# EAGLE design QuantumPCB V1.0 (EAGLE 9.2.0)

## Sheet 1 of 4: Arduino Principal Connections
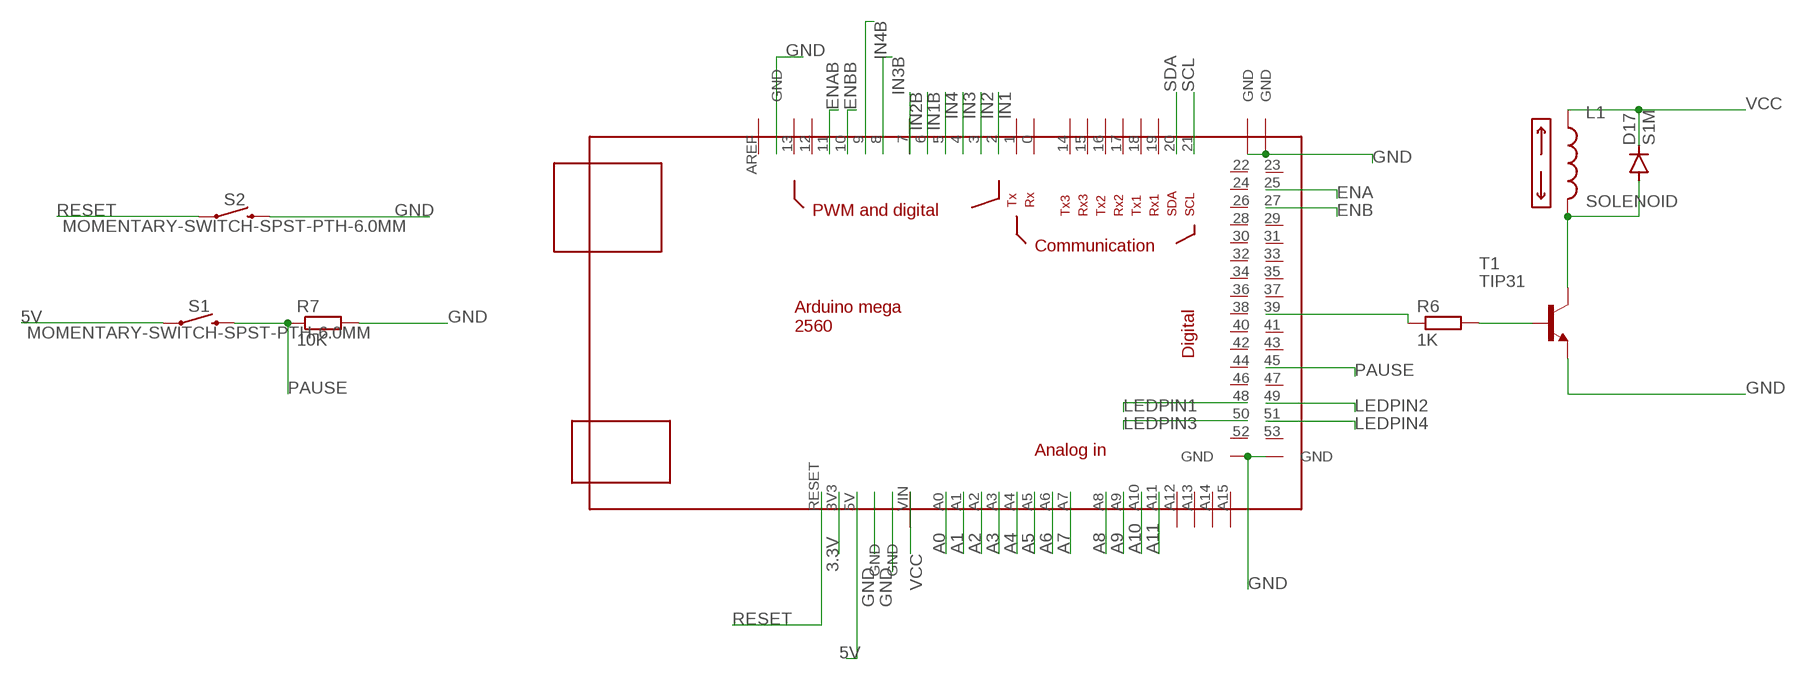
[diagram p0: schematic, sheet 1]

### Parts
D17  S1M  [SMA]
L1  SOLENOID  [1X02]
R6  1K  R-EU_R0603  [R0603]
R7  10K  R-EU_R0603  [R0603]
S1  MOMENTARY-SWITCH-SPST-PTH-6.0MM  [TACTILE_SWITCH_PTH_6.0MM]
S2  MOMENTARY-SWITCH-SPST-PTH-6.0MM  [TACTILE_SWITCH_PTH_6.0MM]
T1  TIP31  [TO220]
U$1  MEGA_DEVICE  [MEGAOUTLINE]

### Nets
3.3V: U$1.3V3 ; also sheet 3
5V: S1.1 U$1.5V ; also sheet 2,3,4
A0: U$1.A0 ; also sheet 2
A1: U$1.A1 ; also sheet 2
A2: U$1.A2 ; also sheet 2
A3: U$1.A3 ; also sheet 2
A4: U$1.A4 ; also sheet 2
A5: U$1.A5 ; also sheet 2
A6: U$1.A6 ; also sheet 2
A7: U$1.A7 ; also sheet 2
A8: U$1.A8 ; also sheet 2
A9: U$1.A9 ; also sheet 2
A10: U$1.A10 ; also sheet 2
A11: U$1.A11 ; also sheet 2
ENA: U$1.25 ; also sheet 4
ENAB: U$1.11 ; also sheet 4
ENB: U$1.27 ; also sheet 4
ENBB: U$1.10 ; also sheet 4
GND: R7.2 S2.3 T1.3(E) U$1.GND@1(GND) U$1.GND@2(GND) U$1.GND@3(GND) U$1.GND@4(GND) U$1.GND@5(GND) U$1.GND@6(GND) U$1.GND@7(GND) ; also sheet 2,3,4
IN1: U$1.2 ; also sheet 4
IN1B: U$1.6 ; also sheet 4
IN2: U$1.3 ; also sheet 4
IN2B: U$1.7 ; also sheet 4
IN3: U$1.4 ; also sheet 4
IN3B: U$1.8 ; also sheet 4
IN4: U$1.5 ; also sheet 4
IN4B: U$1.9 ; also sheet 4
LEDPIN1: U$1.48 ; also sheet 2
LEDPIN2: U$1.49 ; also sheet 2
LEDPIN3: U$1.50 ; also sheet 2
LEDPIN4: U$1.51 ; also sheet 2
N$5: R6.1 U$1.39
N$6: R6.2 T1.1(B)
N$7: D17.A L1.2 T1.2(C)
PAUSE: R7.1 S1.3 U$1.45
RESET: S2.1 U$1.RESET
SCL: U$1.21 ; also sheet 3
SDA: U$1.20 ; also sheet 3
VCC: D17.C L1.1 U$1.VIN ; also sheet 3,4
Unconnected: U$1.0 U$1.1 U$1.12 U$1.13 U$1.14 U$1.15 U$1.16 U$1.17 U$1.18 U$1.19 U$1.22 U$1.23 U$1.24 U$1.26 U$1.28 U$1.29 U$1.30 U$1.31 U$1.32 U$1.33 U$1.34 U$1.35 U$1.36 U$1.37 U$1.38 U$1.40 U$1.41 U$1.42 U$1.43 U$1.44 U$1.46 U$1.47 U$1.52 U$1.53 U$1.A12 U$1.A13 U$1.A14 U$1.A15 U$1.AREF

## Sheet 2 of 4: Light Sensor Connections
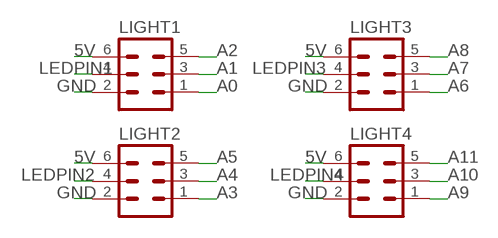
[diagram p1: schematic, sheet 2]

### Parts
LIGHT1  MA03-2  [MA03-2]
LIGHT2  MA03-2  [MA03-2]
LIGHT3  MA03-2  [MA03-2]
LIGHT4  MA03-2  [MA03-2]

### Nets
5V: LIGHT1.6 LIGHT2.6 LIGHT3.6 LIGHT4.6 ; also sheet 1,3,4
A0: LIGHT1.1 ; also sheet 1
A1: LIGHT1.3 ; also sheet 1
A2: LIGHT1.5 ; also sheet 1
A3: LIGHT2.1 ; also sheet 1
A4: LIGHT2.3 ; also sheet 1
A5: LIGHT2.5 ; also sheet 1
A6: LIGHT3.1 ; also sheet 1
A7: LIGHT3.3 ; also sheet 1
A8: LIGHT3.5 ; also sheet 1
A9: LIGHT4.1 ; also sheet 1
A10: LIGHT4.3 ; also sheet 1
A11: LIGHT4.5 ; also sheet 1
GND: LIGHT1.2 LIGHT2.2 LIGHT3.2 LIGHT4.2 ; also sheet 1,3,4
LEDPIN1: LIGHT1.4 ; also sheet 1
LEDPIN2: LIGHT2.4 ; also sheet 1
LEDPIN3: LIGHT3.4 ; also sheet 1
LEDPIN4: LIGHT4.4 ; also sheet 1

## Sheet 3 of 4: I2C Connections
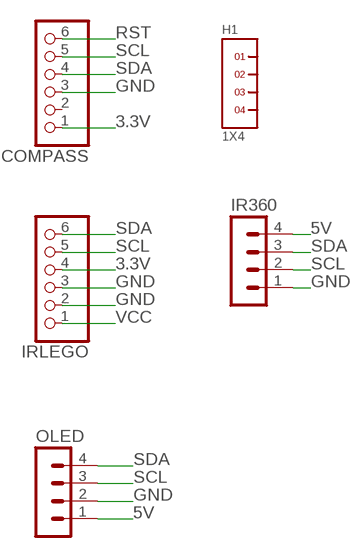
[diagram p2: schematic, sheet 3]

### Parts
COMPASS  PINHD-1X6  [1X06]
H1  1X4  [1X4]
IR360  MA04-1  [MA04-1]
IRLEGO  PINHD-1X6  [1X06]
OLED  MA04-1  [MA04-1]

### Nets
3.3V: COMPASS.1 IRLEGO.4 ; also sheet 1
5V: IR360.4 OLED.1 ; also sheet 1,2,4
GND: COMPASS.3 IR360.1 IRLEGO.2 IRLEGO.3 OLED.2 ; also sheet 1,2,4
RST: COMPASS.6
SCL: COMPASS.5 IR360.2 IRLEGO.5 OLED.3 ; also sheet 1
SDA: COMPASS.4 IR360.3 IRLEGO.6 OLED.4 ; also sheet 1
VCC: IRLEGO.1 ; also sheet 1,4
Unconnected: COMPASS.2 H1.1 H1.2 H1.3 H1.4

## Sheet 4 of 4: Motors and Power Supply
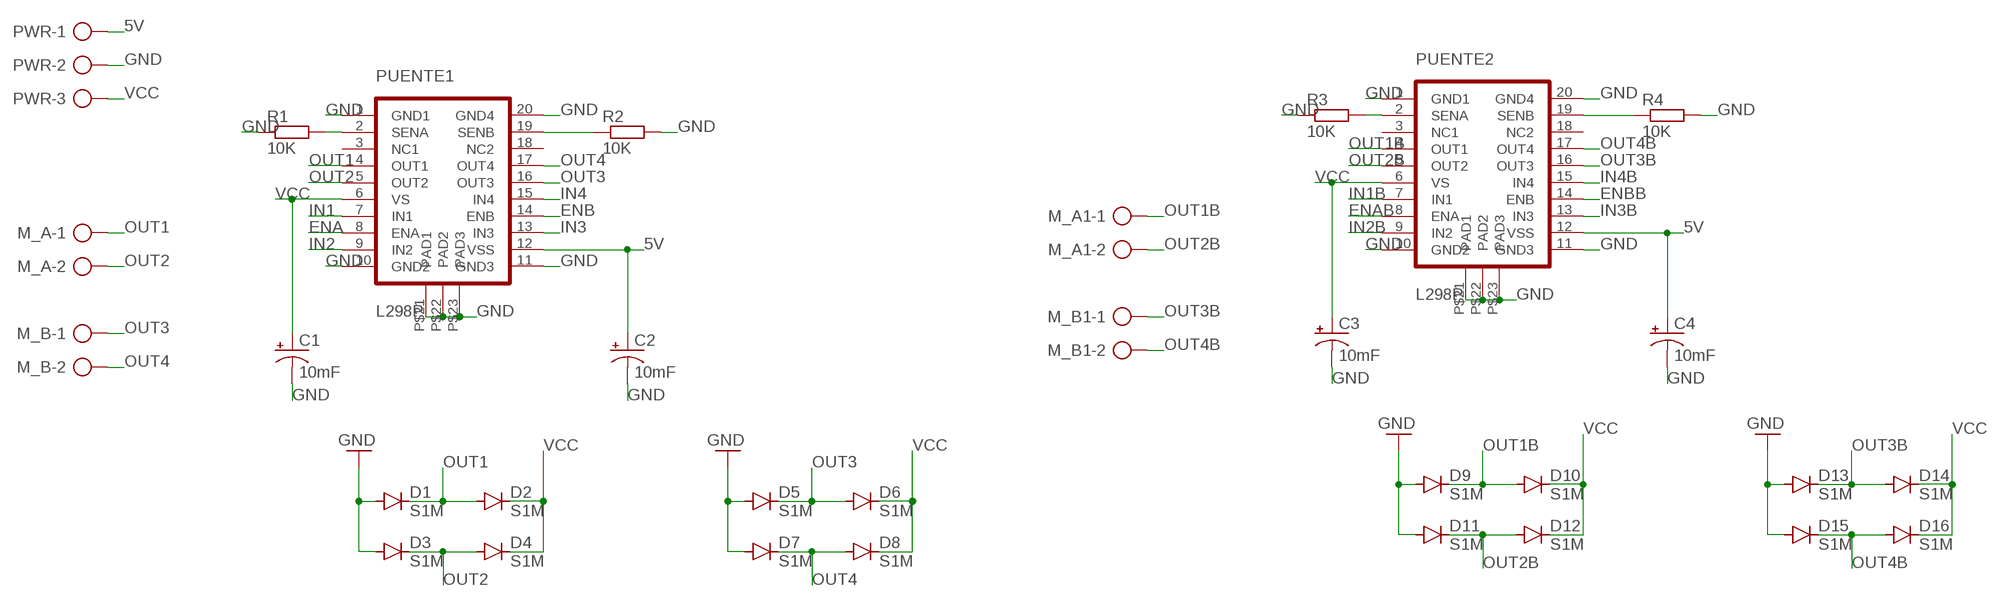
[diagram p3: schematic, sheet 4]

### Parts
C1  10mF  CPOL-USE2-5  [E2-5]
C2  10mF  CPOL-USE2-5  [E2-5]
C3  10mF  CPOL-USE2-5  [E2-5]
C4  10mF  CPOL-USE2-5  [E2-5]
D1  S1M  [SMA]
D2  S1M  [SMA]
D3  S1M  [SMA]
D4  S1M  [SMA]
D5  S1M  [SMA]
D6  S1M  [SMA]
D7  S1M  [SMA]
D8  S1M  [SMA]
D9  S1M  [SMA]
D10  S1M  [SMA]
D11  S1M  [SMA]
D12  S1M  [SMA]
D13  S1M  [SMA]
D14  S1M  [SMA]
D15  S1M  [SMA]
D16  S1M  [SMA]
M_A  AK500/2  [AK500/2]
M_A1  AK500/2  [AK500/2]
M_B  AK500/2  [AK500/2]
M_B1  AK500/2  [AK500/2]
PUENTE1  L298P  [POWER-SO20]
PUENTE2  L298P  [POWER-SO20]
PWR  AK500/3  [AK500/3]
R1  10K  R-EU_R0603  [R0603]
R2  10K  R-EU_R0603  [R0603]
R3  10K  R-EU_R0603  [R0603]
R4  10K  R-EU_R0603  [R0603]

### Nets
5V: C2.+ C4.+ PUENTE1.P$12(VSS) PUENTE2.P$12(VSS) PWR.1 ; also sheet 1,2,3
ENA: PUENTE1.P$8(ENA) ; also sheet 1
ENAB: PUENTE2.P$8(ENA) ; also sheet 1
ENB: PUENTE1.P$14(ENB) ; also sheet 1
ENBB: PUENTE2.P$14(ENB) ; also sheet 1
GND: C1.- C2.- C3.- C4.- D1.A D3.A D5.A D7.A D9.A D11.A D13.A D15.A PUENTE1.P$1(GND1) PUENTE1.P$10(GND2) PUENTE1.P$11(GND3) PUENTE1.P$20(GND4) PUENTE1.P$21(PAD1) PUENTE1.P$22(PAD2) PUENTE1.P$23(PAD3) PUENTE2.P$1(GND1) PUENTE2.P$10(GND2) PUENTE2.P$11(GND3) PUENTE2.P$20(GND4) PUENTE2.P$21(PAD1) PUENTE2.P$22(PAD2) PUENTE2.P$23(PAD3) PWR.2 R1.1 R2.2 R3.1 R4.2 ; also sheet 1,2,3
IN1: PUENTE1.P$7(IN1) ; also sheet 1
IN1B: PUENTE2.P$7(IN1) ; also sheet 1
IN2: PUENTE1.P$9(IN2) ; also sheet 1
IN2B: PUENTE2.P$9(IN2) ; also sheet 1
IN3: PUENTE1.P$13(IN3) ; also sheet 1
IN3B: PUENTE2.P$13(IN3) ; also sheet 1
IN4: PUENTE1.P$15(IN4) ; also sheet 1
IN4B: PUENTE2.P$15(IN4) ; also sheet 1
N$1: PUENTE1.P$2(SENA) R1.2
N$2: PUENTE1.P$19(SENB) R2.1
N$3: PUENTE2.P$2(SENA) R3.2
N$4: PUENTE2.P$19(SENB) R4.1
OUT1: D1.C D2.A M_A.1 PUENTE1.P$4(OUT1)
OUT1B: D9.C D10.A M_A1.1 PUENTE2.P$4(OUT1)
OUT2: D3.C D4.A M_A.2 PUENTE1.P$5(OUT2)
OUT2B: D11.C D12.A M_A1.2 PUENTE2.P$5(OUT2)
OUT3: D5.C D6.A M_B.1 PUENTE1.P$16(OUT3)
OUT3B: D13.C D14.A M_B1.1 PUENTE2.P$16(OUT3)
OUT4: D7.C D8.A M_B.2 PUENTE1.P$17(OUT4)
OUT4B: D15.C D16.A M_B1.2 PUENTE2.P$17(OUT4)
VCC: C1.+ C3.+ D2.C D4.C D6.C D8.C D10.C D12.C D14.C D16.C PUENTE1.P$6(VS) PUENTE2.P$6(VS) PWR.3 ; also sheet 1,3
Unconnected: PUENTE1.P$3(NC1) PUENTE1.P$18(NC2) PUENTE2.P$3(NC1) PUENTE2.P$18(NC2)

## Library data of the parts
C1-C4 = adafruit:CPOL-US: POLARIZED CAPACITOR, American symbol
COMPASS IRLEGO = adafruit:PINHD-1X6: PIN HEADER
D1-D17 = diode:S1M
H1 = headers(.1in):1X4
IR360 OLED = con-lstb:MA04-1: PIN HEADER; OC_FARNELL: unknown; OC_NEWARK: unknown
L1 = my_mixed:SOLENOID
LIGHT1-LIGHT4 = con-lstb:MA03-2: PIN HEADER; OC_FARNELL: unknown; OC_NEWARK: unknown
M_A M_A1 M_B M_B1 = con-ptr500:AK500/2: CONNECTOR; OC_FARNELL: unknown; OC_NEWARK: unknown
PUENTE1 PUENTE2 = L298P:L298P: L298P DUAL FUL-BRIDGE DRIVER PowerSO20; AVAILABILITY: Unavailable; DESCRIPTION: L298 Series Dual Full Bridge 4 A 46 V Driver Surface Mount - PowerSO-20; MF: STMicroelectronics; MP: L298P; PACKAGE: SO-20 STMicroelectronics; PRICE: None
PWR = con-ptr500:AK500/3: CONNECTOR; OC_FARNELL: unknown; OC_NEWARK: unknown
R1-R4 R6 R7 = rcl:R-EU_: RESISTOR, European symbol; SPICEPREFIX: R
S1 S2 = SparkFun-Switches:MOMENTARY-SWITCH-SPST: Momentary Switch (Pushbutton) - SPST Normally-open (NO) SPST momentary switches (buttons, pushbuttons). Variants PTH-12MM - 12mm square, through-hole Momentary Pushbutton Switch - 12mm Square <https://www.sparkfun.com/products/9190> (COM-09190) PTH-6.0MM, PTH-6.0MM-KIT - 6.0mm square, through-hole Mini Pushbutton Switch <https://www.sparkfun.com/products/97> (COM-00097) KIT package intended for soldering kit's - only one side of pads' copper is exposed. PTH-RIGHT-ANGLE-KIT - Right-angle, through-hole Right Angle Tactile Button <https://www.sparkfun.com/products/10791> - Used on SparkFun BigTime Watch Kit <https://www.sparkfun.com/products/11734> SMD-12MM - 12mm square, surface-mount Tactile Button - SMD (12mm) <https://www.sparkfun.com/products/12993> (COM-12993) Used on SparkFun PicoBoard <https://www.sparkfun.com/products/11888> SMD-4.5MM - 4.5mm Square Trackball Switch Used on SparkFun Blackberry Trackballer Breakout <https://www.sparkfun.com/products/13169> SMD-4.6MMX2.8MM - 4.60mm x 2.80mm, surface mount Used on SparkFun SAMD21 Mini Breakout <https://www.sparkfun.com/products/13664> SMD-5.2MM, SMD-5.2-REDUNDANT - 5.2mm square, surface-mount Mini Pushbutton Switch - SMD <https://www.sparkfun.com/products/8720> (COM-08720) Used on Arduino Pro Mini <https://www.sparkfun.com/products/11114> REDUNDANT package connects both switch circuits together SMD-6.0X3.5MM - 6.0 x 3.5mm, surface mount Momentary Reset Switch SMD <https://www.sparkfun.com/products/8229> (COM-08229) SMD-6.2MM-TALL - 6.2mm square, surface mount Tactile Button - SMD (6mm) <https://www.sparkfun.com/products/12992> Used on SparkFun Digital Sandbox <https://www.sparkfun.com/products/12651> SMD-RIGHT-ANGLE - Right-angle, surface mount Used on SparkFun Block for Intel® Edison - Arduino <https://www.sparkfun.com/products/13036>; PROD_ID: SWCH-08441; SF_SKU: COM-00097
T1 = transistor:TIP31: NPN Transistor Medium Power Linear Switching Applications Source: http://onsemi.com
U$1 = ArduinoMegaOutline:MEGA_DEVICE: mega card as device

## Board
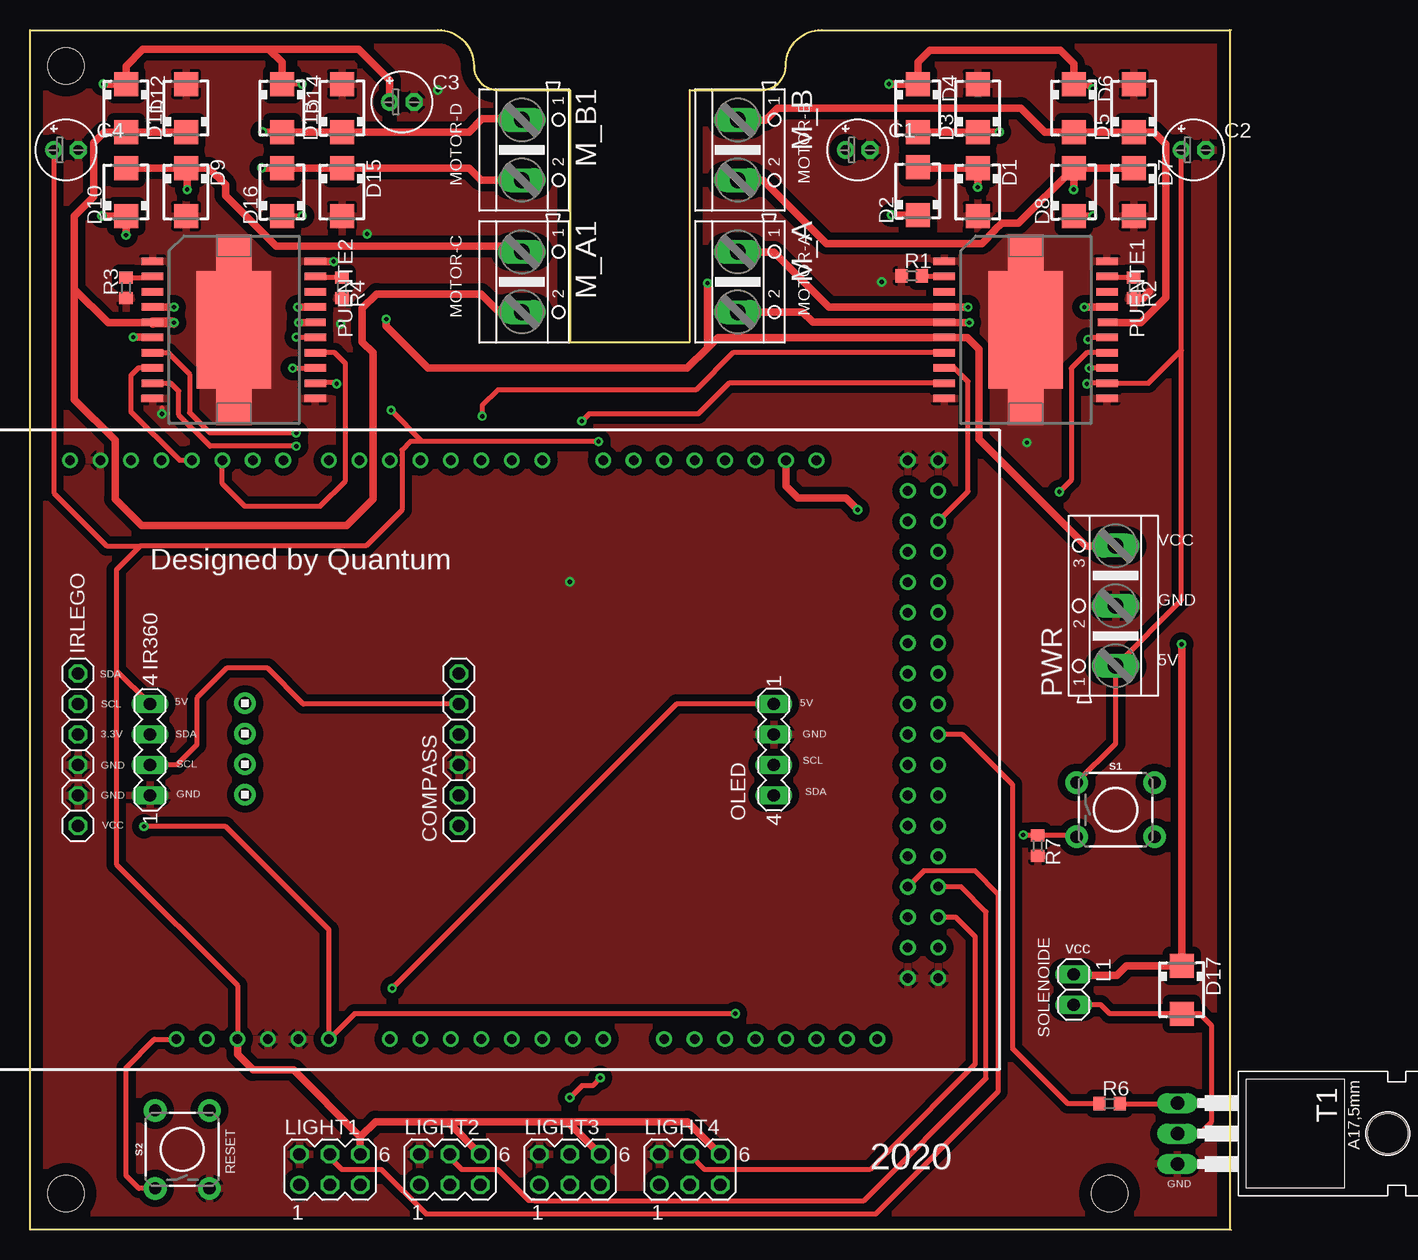
[diagram p4: board, top side]
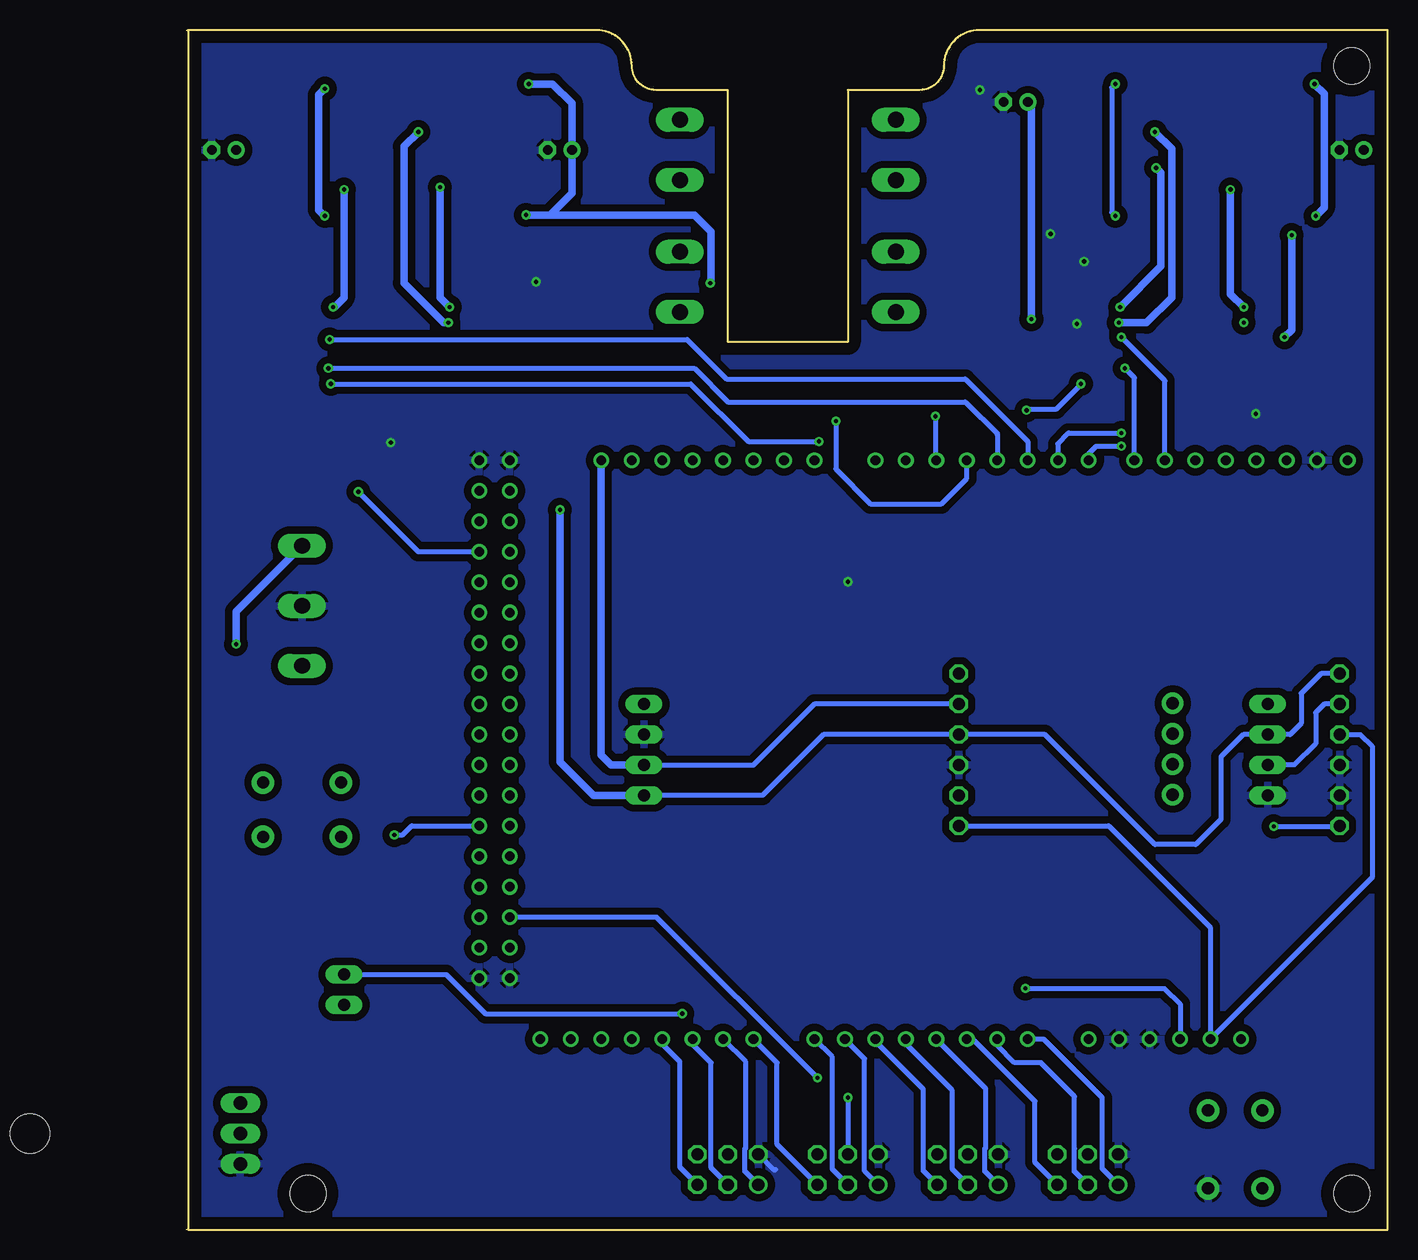
[diagram p5: board, bottom side, seen from below]

Size 100.17 x 100 mm. Coordinates in mm from the lower left corner, seen from the top.
Outline: 100,0 100.17,0
Outline: 100.17,100 100,100
Outline: 100,100 66,100 arc90 63,97 arc-90 61,95 55,95 55,74 45,74 45,95 39,95 arc-90 37,97 arc90 34,100 0,100 0,0 100,0
Outline: 100,100 100,0
Copper layers (1*16): Top 0.035mm / dielectric 1.5mm / Bottom 0.035mm
Design rules "default": minimum track width 6mil, minimum drill 0.35mm, track to track 6mil, track to pad 6mil, pad to pad 6mil, via to via 6mil, smd to smd 6mil, copper to edge 40mil, drill to drill 6mil, minimum pad ring 10mil, minimum via ring 8mil, stop-mask expansion 4mil, vias tented up to drill 0mil, thermal gap 10mil
Holes 3 mm at 3,3 3,97 90,3

### Footprints (pad centres in the part's own frame; a part is rotated, then mirrored left to right if it is on the bottom)
E2-5 = drill 0.813 pad 1.422: + -1.016,0 | drill 0.813 pad 1.422 octagon: - 1.016,0
1X06 = drill 1.016 octagon: 1 -6.35,0; 2 -3.81,0; 3 -1.27,0; 4 1.27,0; 5 3.81,0; 6 6.35,0
SMA = smd 2 x 2: A 2,0; C -2,0
1X4 = drill 1.016 pad 1.778: 1 0,0; 2 2.54,0; 3 5.08,0; 4 7.62,0
MA04-1 = drill 1.016 long: 1 -3.81,0; 2 -1.27,0; 3 1.27,0; 4 3.81,0
1X02 = drill 1.016 long: 1 -1.27,0; 2 1.27,0
MA03-2 = drill 1.016: 1 -2.54,-1.27 | drill 1.016 octagon: 2 -2.54,1.27; 3 0,-1.27; 4 0,1.27; 5 2.54,-1.27; 6 2.54,1.27
AK500/2 = drill 1.321 long: 1 -2.515,0; 2 2.515,0
POWER-SO20 = smd 0.635 x 1.778: P$1 -5.715,-6.782; P$2 -4.445,-6.782; P$3 -3.175,-6.782; P$4 -1.905,-6.782; P$5 -0.635,-6.782; P$6 0.635,-6.782; P$7 1.905,-6.782; P$8 3.175,-6.782; P$9 4.445,-6.782; P$10 5.715,-6.782; P$11 5.715,6.782; P$12 4.445,6.782; P$13 3.175,6.782; P$14 1.905,6.782; P$15 0.635,6.782; P$17 -1.905,6.782; P$18 -3.175,6.782; P$19 -4.445,6.782; P$20 -5.715,6.782 | smd 0.635 x 1.651: P$16 -0.635,6.833 | smd 9.804 x 6.198: P$21 0,0 | smd 3.048 x 2.921: P$22 -6.426,0; P$23 6.426,0
AK500/3 = drill 1.321 long: 1 -5.004,0; 2 0,0; 3 5.004,0
R0603 = smd 1 x 1.1: 1 -0.85,0; 2 0.85,0
TACTILE_SWITCH_PTH_6.0MM = drill 1.016 pad 1.88: 1 -3.251,2.261; 2 3.251,2.261; 3 -3.251,-2.261; 4 3.251,-2.261
TO220 = drill 1.118 long: 1 -2.54,-6.35; 2 0,-6.35; 3 2.54,-6.35 | hole 3.302: 0,11.176
MEGAOUTLINE = drill 0.8: 0 12.7,24.13; 1 10.16,24.13; 2 7.62,24.13; 3 5.08,24.13; 3V3 -15.24,-24.13; 4 2.54,24.13; 5 0,24.13; 5V -12.7,-24.13; 6 -2.54,24.13; 7 -5.08,24.13; 8 -8.89,24.13; 9 -11.43,24.13; 10 -13.97,24.13; 11 -16.51,24.13; 12 -19.05,24.13; 13 -21.59,24.13; 14 17.78,24.13; 15 20.32,24.13; 16 22.86,24.13; 17 25.4,24.13; 18 27.94,24.13; 19 30.48,24.13; 20 33.02,24.13; 21 35.56,24.13; 22 43.18,21.59; 23 45.72,21.59; 24 43.18,19.05; 25 45.72,19.05; 26 43.18,16.51; 27 45.72,16.51; 28 43.18,13.97; 29 45.72,13.97; 30 43.18,11.43; 31 45.72,11.43; 32 43.18,8.89; 33 45.72,8.89; 34 43.18,6.35; 35 45.72,6.35; 36 43.18,3.81; 37 45.72,3.81; 38 43.18,1.27; 39 45.72,1.27; 40 43.18,-1.27; 41 45.72,-1.27; 42 43.18,-3.81; 43 45.72,-3.81; 44 43.18,-6.35; 45 45.72,-6.35; 46 43.18,-8.89; 47 45.72,-8.89; 48 43.18,-11.43; 49 45.72,-11.43; 50 43.18,-13.97; 51 45.72,-13.97; 52 43.18,-16.51; 53 45.72,-16.51; A0 0,-24.13; A1 2.54,-24.13; A2 5.08,-24.13; A3 7.62,-24.13; A4 10.16,-24.13; A5 12.7,-24.13; A6 15.24,-24.13; A7 17.78,-24.13; A8 22.86,-24.13; A9 25.4,-24.13; A10 27.94,-24.13; A11 30.48,-24.13; A12 33.02,-24.13; A13 35.56,-24.13; A14 38.1,-24.13; A15 40.64,-24.13; AREF -26.67,24.13; GND@1 -24.13,24.13; GND@2 -10.16,-24.13; GND@3 -7.62,-24.13; GND@4 43.18,24.13; GND@5 45.72,24.13; GND@6 43.18,-19.05; GND@7 45.72,-19.05; RESET -17.78,-24.13; VIN -5.08,-24.13

### Placement (x,y rotation side)
C1  69,90 0 top
C2  97,90 0 top
C3  31,94 0 top
C4  3,90 0 top
COMPASS  35.75,40 90 top
D1  79,86.5 270 top
D2  74,86.58 90 top
D3  79,93.5 90 top
D4  74,93.5 270 top
D5  92,93.5 90 top
D6  87,93.5 270 top
D7  92,86.5 270 top
D8  87,86.5 90 top
D9  13,86.5 270 top
D10  8,86.5 90 top
D11  13,93.5 90 top
D12  8,93.5 270 top
D13  26,93.5 90 top
D14  21,93.5 270 top
D15  26,86.5 270 top
D16  21,86.5 90 top
D17  96,20 270 top
H1  17.92,36.25 90 top
IR360  10,40 90 top
IRLEGO  4,40 90 top
L1  87,20 270 top
LIGHT1  25,5 0 top
LIGHT2  35,5 0 top
LIGHT3  45,5 0 top
LIGHT4  55,5 0 top
M_A  59,79 270 top
M_A1  41,79 270 top
M_B  59,90 270 top
M_B1  41,90 270 top
OLED  62,40 270 top
PUENTE1  83,75 270 top
PUENTE2  17,75 270 top
PWR  90.5,52 90 top
R1  73.5,79.5 0 top
R2  92,78.5 270 top
R3  8,78.5 90 top
R4  26,78.5 270 top
R6  90,10.5 0 top
R7  84,32 270 top
S1  90.5,35 0 top
S2  12.7,6.68 90 top
T1  102,8 270 top
U$1  30,40 0 top

### Tracks (layer width: path | path; a pad name or v marks a point on that pad's centre or on a via)
3.3V
  Bottom 0.406: COMPASS.1 23.25,33.65 14.8,25.2 14.8,16.11 14.9,16.01 | IRLEGO.4 2.27,41.27 1.29,40.3 1.29,29.34 U$1.3V3
  Bottom 0.61: 14.9,16.01 U$1.3V3
5V  (via drill 0.35)
  Top 0.406: C4.+ 1.98,61.42 6.4,57 9.2,57 | 7.2,46.61 7.2,55 9.2,57 | S1.1 90.5,40.51 PWR.1 95.98,52.48 95.98,73.3 | 95.98,73.3 C2.+ | 95.98,73.3 93.24,70.56 PUENTE1.P$12 88.16,70.56 v88.1,70.5 | v47.4,65.7 32.7,65.7 | 32.7,65.7 v30.1,68.3 | 32.7,65.7 31.7,65.7 31,65 31,64.56 31.01,64.55 31.01,63.71 31,63.7 31,60 28,57 9.2,57 | PUENTE2.P$12 23.83,70.6 25.47,70.6 v25.57,70.5 | IR360.4 7.2,46.61 | OLED.1 53.91,43.81 v30.2,20.1 | U$1.5V 17.3,20.35 7.2,30.45 7.2,46.61
  Top 0.61: 35,9 28.8,9 27.54,7.74 | 35,9 44.81,9 | 44.81,9 54.81,9 LIGHT4.6 | LIGHT1.6 27.54,7.74 | 27.54,7.74 21.98,13.3 18.6,13.3 17.3,14.6 U$1.5V | LIGHT3.6 44.81,9 | LIGHT2.6 35,8.81 35,9
  Bottom 0.406: v88.1,70.5 58.1,70.5 53.3,65.7 v47.4,65.7 | v30.1,68.3 30,68.4 27.6,68.4 25.57,70.43 v25.57,70.5 | v30.2,20.1 18.6,20.1 17.3,18.8 U$1.5V
A0
  Bottom 0.406: LIGHT1.1 23.8,5.07 23.8,11 28.67,15.87 U$1.A0
A1
  Bottom 0.406: LIGHT1.3 26.12,4.85 26.12,6.73 26.1,6.75 26.1,11.1 28.9,13.9 31.1,13.9 32.54,15.34 U$1.A1
A2
  Bottom 0.406: LIGHT1.5 29.4,5.59 29.4,10.7 34.57,15.87 U$1.A2
A3
  Bottom 0.406: LIGHT2.1 33.58,4.85 33.58,6.73 33.5,6.81 33.5,11.75 U$1.A3
A4
  Bottom 0.406: LIGHT2.3 36.3,5.03 36.3,11.6 40.16,15.46 U$1.A4
A5
  Bottom 0.406: LIGHT2.5 38.7,4.89 38.7,11.7 42.7,15.7 U$1.A5
A6
  Bottom 0.406: LIGHT3.1 43.6,4.87 43.6,14.23 U$1.A6
A7
  Bottom 0.406: LIGHT3.3 46.3,5.03 46.3,14.39 U$1.A7
A8
  Bottom 0.406: LIGHT3.5 50.9,7.09 50.9,13.91 U$1.A8
A9
  Bottom 0.406: LIGHT4.1 53.58,4.85 53.58,6.73 53.5,6.81 53.5,13.97 U$1.A9
A10
  Bottom 0.406: LIGHT4.3 56.4,5.13 56.4,13.9 57.94,15.44 U$1.A10
A11
  Bottom 0.406: LIGHT4.5 59,5.19 59,14 60.48,15.48 U$1.A11
ENA
  Top 0.406: U$1.25 78.2,61.53 78.2,70.7 77.08,71.83 PUENTE1.P$8
ENAB
  Top 0.406: PUENTE2.P$8 9.03,71.83 8.4,71.2 8.4,68.2 12.47,64.13 U$1.11
ENB  (via drill 0.35)
  Top 0.406: PUENTE1.P$14 88.09,73.09 86.8,71.8 86.8,62.5 v85.8,61.5
  Bottom 0.406: v85.8,61.5 80.81,56.51 U$1.27
ENBB
  Top 0.406: PUENTE2.P$14 25.41,73.09 26.3,72.2 26.3,62.4 24.2,60.3 17.9,60.3 16.03,62.17 U$1.10
GND  (via drill 0.35)
  Top 0.406: v11,68 11,68.5
  Top 0.61: R2.2 92.75,77.65 93.3,78.2 | PUENTE2.P$20 23.8,80.7 v25.3,80.7
  Bottom 0.406: LIGHT4.2 51.19,5 51,5
  other vias: 45,54 34,95 28.1,83 71,79 83.1,65.6 25.9,75.5
  pour Top (isolate 0.61): 0,100 35,100 37,98 37,96 38,95 40,95 45,95 45,74 55,74 55,95 62,95 63,96 63,98 64,99 65,100 69,100 100,100 100,0 0,0
  pour Bottom (isolate 0.61): 0,100 100,100 100,0 0,0
IN1  (via drill 0.35)
  Top 0.406: PUENTE1.P$7 58.59,73.09 55.5,70 39,70 37.7,68.7 v37.7,67.8 37.7,67.7
  Bottom 0.406: v37.7,67.8 37.7,64.21 U$1.2
IN1B  (via drill 0.35)
  Top 0.406: PUENTE2.P$7 11.51,73.09 13.3,71.3 13.3,68.1 15,66.4 v22.2,66.4
  Bottom 0.406: U$1.6 27.46,65.46 27.5,65.5 26.6,66.4 v22.2,66.4 22.1,66.4
IN2  (via drill 0.35)
  Top 0.406: PUENTE1.P$9 58.26,70.56 55.7,68 46.6,68 v46,67.4
  Bottom 0.406: v46,67.4 46,63.4 43.1,60.5 37.2,60.5 35.08,62.62 U$1.3
IN2B  (via drill 0.35)
  Top 0.406: PUENTE2.P$9 11.74,70.56 12.4,69.9 12.4,67.9 15,65.3 v22.2,65.3
  Bottom 0.406: U$1.7 24.92,64.68 24.3,65.3 v22.2,65.3
IN3  (via drill 0.35)
  Top 0.406: PUENTE1.P$13 88.33,71.83 v88.3,71.8
  Bottom 0.406: v88.3,71.8 57.8,71.8 55,69 35.2,69 32.5,66.3 32.54,66.26 U$1.4
IN3B  (via drill 0.35)
  Top 0.406: v21.9,71.8 23.76,71.8 PUENTE2.P$13
  Bottom 0.406: U$1.8 21.11,71.01 v21.9,71.8
IN4  (via drill 0.35)
  Top 0.406: PUENTE1.P$15 88.36,74.36 v88.2,74.2
  Bottom 0.406: v88.2,74.2 58.4,74.2 55.1,70.9 35.2,70.9 30,65.7 U$1.5
IN4B  (via drill 0.35)
  Top 0.406: v22.2,74.4 23.75,74.4 PUENTE2.P$15
  Bottom 0.406: U$1.9 18.57,70.77 v22.2,74.4
LEDPIN1
  Top 0.406: U$1.48 74.51,29.9 78.8,29.9 80.7,28 80.7,11.49 70.5,1.29 33,1.29 29.3,5 26,5 25,6 LIGHT1.4
LEDPIN2
  Top 0.406: U$1.49 77.63,28.57 79.7,26.5 79.7,12.6 69.5,2.4 42,2.4 41.6,2.4 39,5 36,5 35,6 LIGHT2.4
LEDPIN3  (via drill 0.35)
  Top 0.406: v47.54,12.64 46.9,12 46,12 v45,11
  Bottom 0.406: U$1.50 60.93,26.03 v47.54,12.64 | v45,11 LIGHT3.4
LEDPIN4
  Top 0.406: U$1.51 77.17,26.03 78.8,24.4 78.8,13.8 71.5,6.5 71.27,6.27 70,5 56.27,5 LIGHT4.4
N$1
  Top 0.406: PUENTE1.P$2 76.12,79.35 75.97,79.5 R1.2
N$2
  Top 0.406: R2.1 89.88,79.35 PUENTE1.P$19
N$3
  Top 0.406: R3.2 10.12,79.35 PUENTE2.P$2
N$4
  Top 0.406: R4.1 23.88,79.35 PUENTE2.P$19
N$5
  Top 0.406: R6.1 86.5,10.5 81.9,15.1 81.9,37.1 77.73,41.27 U$1.39
N$6
  Top 0.406: R6.2 95.55,10.5 arc45 T1.1
N$7
  Top 0.406: T1.2 97.5,8 98.5,9 98.5,17 97.5,18 D17.A 90,18 89.27,18.73 L1.2
OUT1  (via drill 0.35)
  Top 0.61: D2.A 74.08,88.5 D1.C v79,86.9 | v78.2,76.9 PUENTE1.P$4 66.6,76.9 62,81.5 59.02,81.5 M_A.1
  Bottom 0.61: v79,86.9 79,77.7 v78.2,76.9
OUT1B  (via drill 0.35)
  Top 0.61: v12,76.9 v11.99,76.91 PUENTE2.P$4 | D9.C 13.1,88.4 v13.1,86.7 | D9.C 14.9,88.5 16.3,87.1 16.3,86.2 20.5,82 40.52,82 M_A1.1 | D9.C D10.A
  Bottom 0.61: v13.1,86.7 13.1,78 v12,76.9
OUT2  (via drill 0.35)
  Top 0.61: D4.A D3.C v80.8,91.5 | M_A.2 64.42,76.48 65.27,75.64 PUENTE1.P$5 76.25,75.6 v78.3,75.6
  Bottom 0.61: v78.3,75.6 78.7,75.6 82,78.9 82,90.3 v80.8,91.5
OUT2B  (via drill 0.35)
  Top 0.61: D11.C D12.A 6.2,91.5 5.3,90.6 5.3,86.1 3.7,84.5 3.7,78.4 | 3.7,78.4 6.5,75.6 10.25,75.6 | 3.7,78.4 3.7,69.2 7.1,65.8 7.1,60.9 9.3,58.7 26.4,58.7 28.6,60.9 28.6,73.1 27.7,74 27.7,76.8 28.9,78 37.6,78 39.1,76.5 40.98,76.5 M_A1.2
  Top 0.813: v12,75.6 10.25,75.6 PUENTE2.P$5
OUT3
  Top 0.61: M_B.1 59.02,92.5 61.3,92.5 62.3,93.5 82.6,93.5 84.6,91.5 D6.A D5.C 93.7,91.5 94.7,90.5 94.7,77.7 92.6,75.6 89.87,75.6 PUENTE1.P$16
OUT3B  (via drill 0.35)
  Top 0.61: v22.4,75.6 23.8,75.6 PUENTE2.P$16 | v19.4,91.5 D14.A D13.C 36.6,91.5 37.7,92.6 40.91,92.6 M_B1.1
  Bottom 0.61: v19.4,91.5 18,90.1 18,77.7 20.1,75.6 v22.4,75.6
OUT4  (via drill 0.35)
  Top 0.61: D8.A D7.C | D7.C 92.5,88.5 92.7,88.7 92.2,88.7 D7.C | v87.9,76.9 PUENTE1.P$17 | D8.A v87,86.7 | D8.A 82.4,83.9 81,83.9 80.46,83.36 80.46,83.31 79.35,82.2 66.4,82.2 61.12,87.48 M_B.2
  Bottom 0.61: v87,86.7 87,77.7 87.8,76.9 v87.9,76.9
OUT4B  (via drill 0.35)
  Top 0.61: v19.3,88.5 D16.A D15.C 36.6,88.5 37.62,87.48 M_B1.2 | v22.3,76.9 PUENTE2.P$17
  Bottom 0.61: v19.3,88.5 18.9,88.1 18.9,80.3 v22.3,76.9
PAUSE  (via drill 0.35)
  Top 0.406: S1.3 87.14,32.85 R7.1 83.05,32.85 83,32.9 v82.8,32.9
  Bottom 0.406: v82.8,32.9 82.1,32.9 81.35,33.65 U$1.45
RESET
  Top 0.406: S2.1 9.07,3.43 8,4.5 8,13.5 10.37,15.87 U$1.RESET
SCL
  Top 0.406: COMPASS.5 22.79,43.81 19.8,46.8 16.4,46.8 13.9,44.3 13.9,40.4 12.23,38.73 IR360.2
  Bottom 0.406: COMPASS.5 47.79,43.81 52.9,38.7 61.97,38.7 OLED.3 | IRLEGO.5 5.29,43.81 6,43.1 6,40.5 7.77,38.73 IR360.2
  Bottom 0.61: OLED.3 64.73,38.73 65.56,39.56 U$1.21
SDA  (via drill 0.35)
  Top 0.61: v69,60 68,61 64,61 63.02,61.98 U$1.20
  Bottom 0.406: OLED.4 52.1,36.2 47.03,41.27 COMPASS.4 28.57,41.27 19.4,32.1 16,32.1 13.9,34.2 13.9,39.4 12.03,41.27 IR360.3 8.13,41.27 7.2,42.2 7.2,44.7 5.55,46.35 IRLEGO.6
  Bottom 0.61: OLED.4 66.19,36.19 69,39 v69,60
VCC  (via drill 0.35)
  Top 0.406: v22.7,95.5 D14.C | v22.7,84.5 D16.C | v58.8,18 27.05,18 U$1.VIN 24.92,24.98 16.3,33.6 v9.5,33.6
  Top 0.61: 19.9,98.4 9.4,98.4 8,97 D12.C v6.1,95.5 | D14.C 21,97.3 19.9,98.4 | 19.9,98.4 27.4,98.4 29.98,95.82 C3.+ | v8,82.9 D10.C v6,84.5 | PUENTE2.P$6 10.18,74.4 v8.6,74.4 | PWR.3 88,57 79.1,65.9 79.1,73.4 78.14,74.36 PUENTE1.P$6 57.34,74.36 56.47,73.5 | 68.2,90.22 C1.+ | v71.82,84.58 D2.C | 56.47,73.5 54.78,71.8 33.2,71.8 29.7,75.3 v29.7,75.9 | L1.1 87.07,21.2 90.6,21.2 91.4,22 D17.C v96,48.8 | v88.6,84.5 D8.C | v88.6,95.1 88.2,95.5 D6.C 87,97.2 85.9,98.3 75,98.3 74,97.3 D4.C v71.6,95.5 | v56.47,78.9 56.47,73.5
  Bottom 0.406: v22.7,95.5 23,95.2 23,84.8 v22.7,84.5 | L1.1 78.47,21.27 75.2,18 v58.8,18 | v9.5,33.6 4.05,33.6 IRLEGO.1
  Bottom 0.61: v8,82.9 8,75 v8.6,74.4 | v96,48.8 96,51.5 PWR.3 | v88.6,95.1 89.1,94.6 89.1,85 v88.6,84.5 | C3.+ 29.7,93.72 v29.7,75.9 | v71.6,95.5 69.6,95.5 68,93.9 68,90.02 | 68,90.02 C1.+ | v71.82,84.58 69.82,84.58 | 69.82,84.58 68,86.4 68,90.02 | 69.82,84.58 57.78,84.58 56.4,83.2 56.4,79 56.47,78.93 v56.47,78.9 | v6.1,95.5 5.3,94.7 5.3,85.2 v6,84.5

### Text on the board
tPlace: Designed by Quantum
tNames: MOTOR-B | MOTOR-D | MOTOR-A | MOTOR-C | VCC | GND | 5V | SDA | SCL | 5V | 5V | 3.3V | SDA | GND | SCL | GND | SCL | GND | GND | SDA | VCC | vcc | SOLENOIDE | RESET | 2020 | GND